# Altium schematic sheet [2]Micro_USB_B.SchDoc
size A4; SheetNumber: 2; SheetTotal: 5
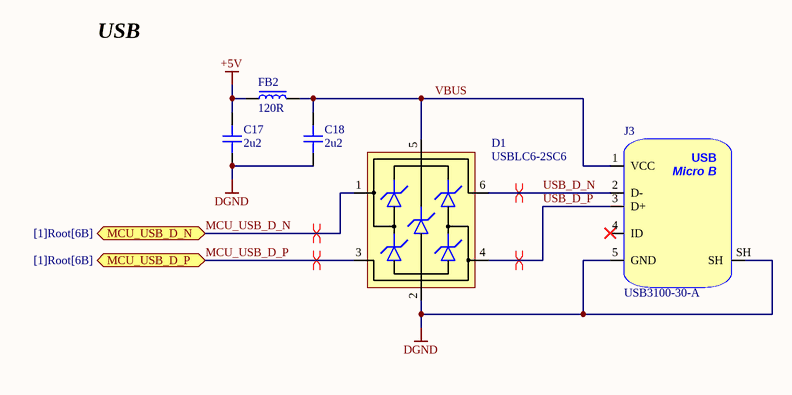
[diagram p0: [2]Micro_USB_B.SchDoc]

## Parts
C17  2u2  [CAP_0603]
C18  2u2  [CAP_0603]
D1  USBLC6-2SC6  [SOT-23-6]
FB2  120R  [FB_0603]
J3  USB3100-30-A  [USB3100-30-A]

## Ports
MCU_USB_D_N (bidir, see [1]Root[6B]), MCU_USB_D_P (bidir, see [1]Root[6B])

## Nets
+5V: C17.2 FB2.1
DGND: C17.1 C18.1 D1.2(GND) J3.5(GND) J3.SH
MCU_USB_D_N: D1.1(IO1) ; port MCU_USB_D_N
MCU_USB_D_P: D1.3(IO2) ; port MCU_USB_D_P
USB_D_N: D1.6(IO1) J3.2(D-)
USB_D_P: D1.4(IO2) J3.3(D+)
VBUS: C18.2 D1.5(VBUS) FB2.2 J3.1(VCC)

Not connected (* = marked no-connect by the designer): J3 4(ID)*

## Layout directives
differential pair: MCU_USB_D_N, MCU_USB_D_P, USB_D_N, USB_D_P

## Notes on the sheet
- USB
- (in symbol USB3100-30-A) USB; Micro B

## Library data of the parts
C17 C18 = CAP_0603: 16V; Manufacturer: *; Manufacturer Part Number: *; Distributor Link: *; LCSC: *; Rating: *; Dielectric: *
D1 = USBLC6-2SC6: Low-Capacitance ESD Protection USB; Manufacturer: STMicroelectronics; Manufacturer Part Number: USBLC6-2SC6; Distributor Link: https://www.mouser.de/ProductDetail/STMicroelectronics/USBLC6-2SC6?qs=po45yt2pPpu%2FhNIlwQdTlg%3D%3D
FB2 = FB_0603: 30mOhm; Manufacturer: *; Manufacturer Part Number: *; Distributor Link: *; LCSC: *
J3 = USB3100-30-A: USB Connector Type Micro B 2.0 SMD Reverse Mount; Manufacturer: GCT; Manufacturer Part Number: USB3100-30-A